# Altium schematic sheet Toberemoved_Principal.SchDoc
size A4; SheetNumber: 2; SheetTotal: 6
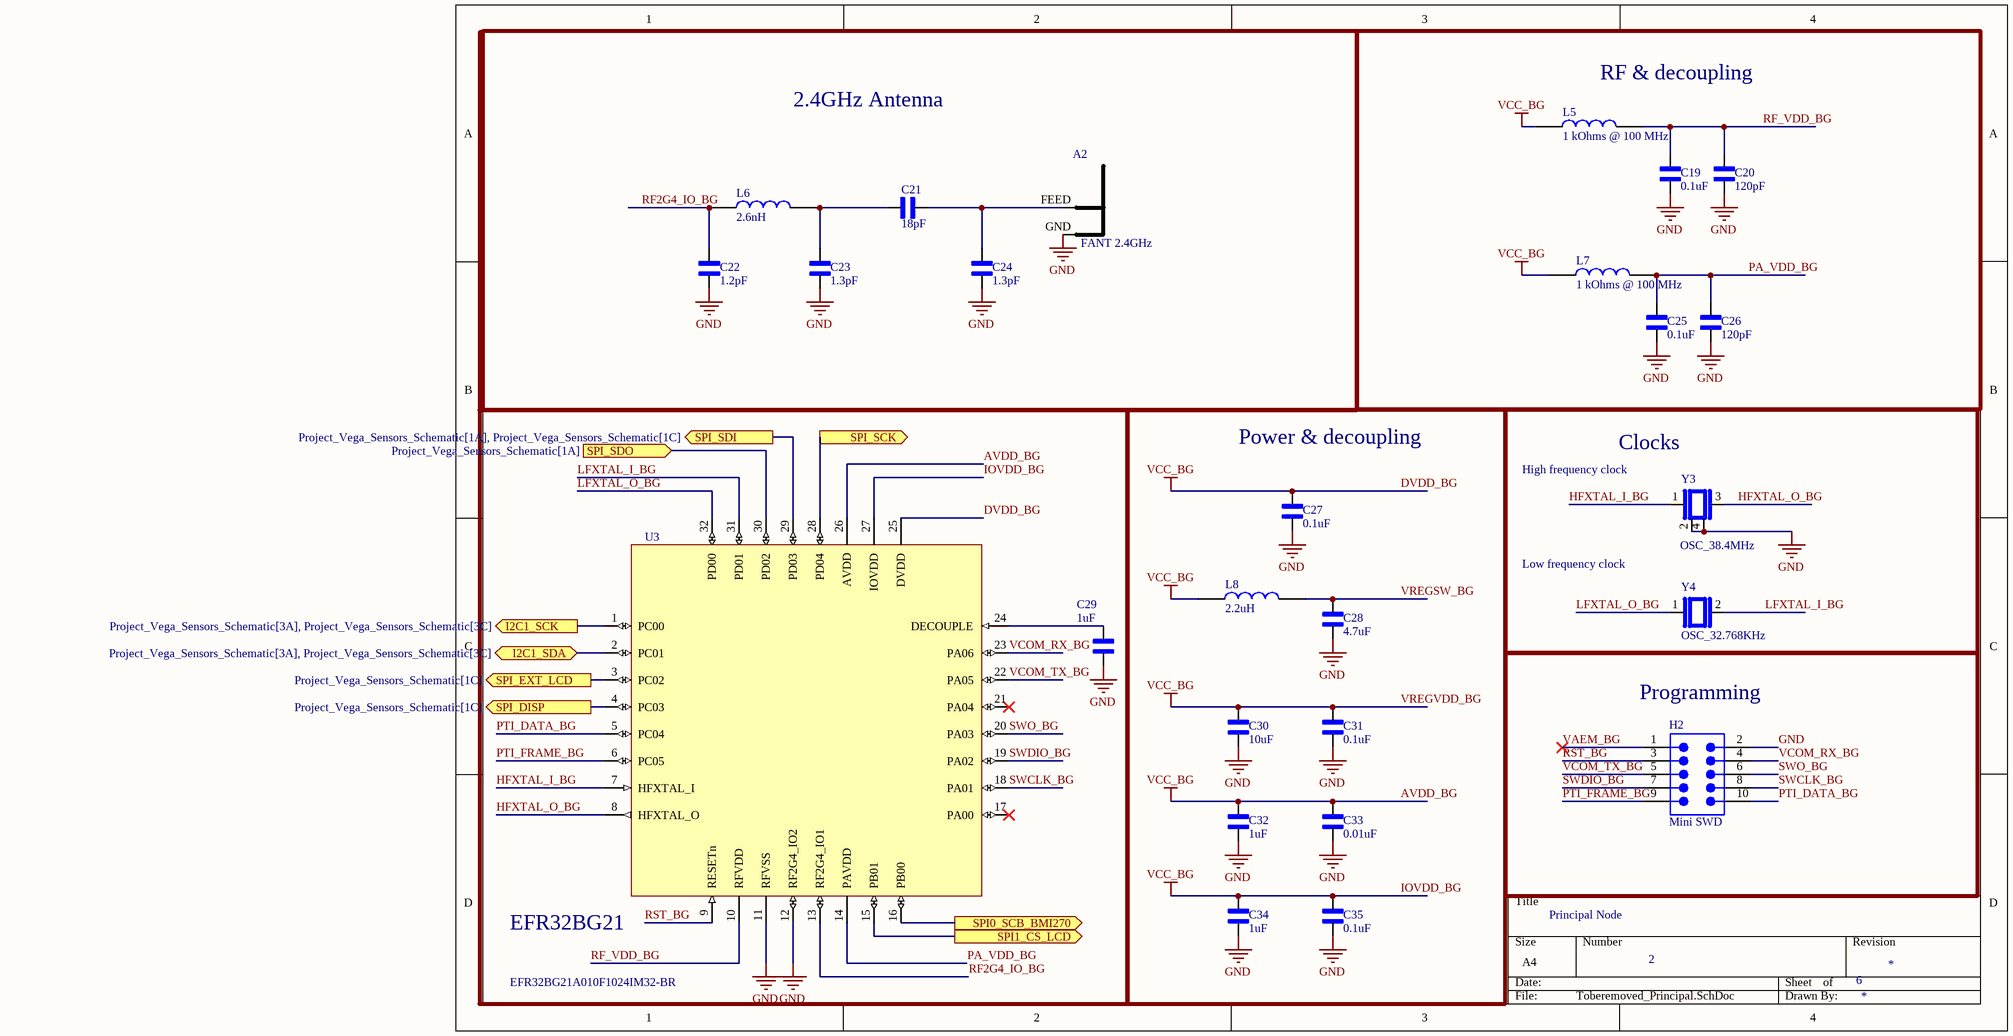
[diagram p0: Toberemoved_Principal.SchDoc]

## Parts
A2  FANT 2.4GHz  [FANT_2P4]
C19  0.1uF  [CAPC1608X90]
C20  120pF  [CAPC1608X90]
C21  18pF  [CAPC1608X90]
C22  1.2pF  [CAPC1608X90]
C23  1.3pF  [CAPC1608X90]
C24  1.3pF  [CAPC1608X90]
C25  0.1uF  [CAPC1608X90]
C26  120pF  [CAPC1608X90]
C27  0.1uF  [CAPC1608X90]
C28  4.7uF  [CAPC1608X90]
C29  1uF  [CAPC1608X90]
C30  10uF  [CAPC1608X90]
C31  0.1uF  [CAPC1608X90]
C32  1uF  [CAPC1608X90]
C33  0.01uF  [CAPC1608X90]
C34  1uF  [CAPC1608X90]
C35  0.1uF  [CAPC1608X90]
H2  Mini SWD  [FTSH-105-01-XXX-DV-K]
L5  1 kOhms @ 100 MHz  [INDC1608X95N]
L6  2.6nH  [INDC1608X95N]
L7  1 kOhms @ 100 MHz  [INDC1608X95N]
L8  2.2uH  [INDC1608X95N]
U3  EFR32BG21A010F1024IM32-BR  [QFN32-EFR32xG2xIM32-BR]
Y3  OSC_38.4MHz  [OSC_38.4MHz]
Y4  OSC_32.768KHz  [OSC_32.768KHz]

## Blocks framed on the sheet
2.4GHz Antenna: A2 C21-C24 L6
RF & decoupling: C19 C20 C25 C26 L5 L7
EFR32BG21: C29 U3
Power & decoupling: C27 C28 C30-C35 L8
Clocks: Y3 Y4
Programming: H2

## Ports
I2C1_SCK (out, see Project_Vega_Sensors_Schematic[3A], Project_Vega_Sensors_Schematic[3C]), I2C1_SDA (bidir, see Project_Vega_Sensors_Schematic[3A], Project_Vega_Sensors_Schematic[3C]), SPI0_SCB_BMI270 (out, see Project_Vega_Sensors_Schematic[1A]), SPI1_CS_LCD (out, see Project_Vega_Sensors_Schematic[1C]), SPI_DISP (out, see Project_Vega_Sensors_Schematic[1C]), SPI_EXT_LCD (out, see Project_Vega_Sensors_Schematic[1C]), SPI_SCK (out, see Project_Vega_Sensors_Schematic[1A], Project_Vega_Sensors_Schematic[1C]), SPI_SDI (out, see Project_Vega_Sensors_Schematic[1A], Project_Vega_Sensors_Schematic[1C]), SPI_SDO (in, see Project_Vega_Sensors_Schematic[1A])

## Nets
AVDD_BG: C27.1 C30.1 C31.1 C32.1 C33.1 C34.1 C35.1 L5.1 L7.1 L8.1 U3.25(DVDD) U3.26(AVDD) U3.27(IOVDD)  [also labelled DVDD_BG, IOVDD_BG, VCC_BG, VREGVDD_BG]
GND: A2.GND C19.2 C20.2 C22.2 C23.2 C24.2 C25.2 C26.2 C27.2 C28.2 C29.2 C30.2 C31.2 C32.2 C33.2 C34.2 C35.2 H2.2 U3.11(RFVSS) U3.12(RF2G4_IO2) Y3.2 Y3.4
HFXTAL_I_BG: U3.7(HFXTAL_I) Y3.1
HFXTAL_O_BG: U3.8(HFXTAL_O) Y3.3
I2C1_SCK: U3.1(PC00) ; port I2C1_SCK
I2C1_SDA: U3.2(PC01) ; port I2C1_SDA
LFXTAL_I_BG: U3.31(PD01) Y4.2
LFXTAL_O_BG: U3.32(PD00) Y4.1
PA_VDD_BG: C25.1 C26.1 L7.2 U3.14(PAVDD)
PTI_DATA_BG: H2.10 U3.5(PC04)
PTI_FRAME_BG: H2.9 U3.6(PC05)
RF2G4_IO_BG: C22.1 L6.1 U3.13(RF2G4_IO1)
RF_VDD_BG: C19.1 C20.1 L5.2 U3.10(RFVDD)
RST_BG: H2.3 U3.9(RESETn)
SPI0_SCB_BMI270: U3.16(PB00) ; port SPI0_SCB_BMI270
SPI1_CS_LCD: U3.15(PB01) ; port SPI1_CS_LCD
SPI_DISP: U3.4(PC03) ; port SPI_DISP
SPI_EXT_LCD: U3.3(PC02) ; port SPI_EXT_LCD
SPI_SCK: U3.28(PD04) ; port SPI_SCK
SPI_SDI: U3.29(PD03) ; port SPI_SDI
SPI_SDO: U3.30(PD02) ; port SPI_SDO
SWCLK_BG: H2.8 U3.18(PA01)
SWDIO_BG: H2.7 U3.19(PA02)
SWO_BG: H2.6 U3.20(PA03)
VAEM_BG: H2.1
VCOM_RX_BG: H2.4 U3.23(PA06)
VCOM_TX_BG: H2.5 U3.22(PA05)
VREGSW_BG: C28.1 L8.2
NetA2_FEED: A2.FEED C21.2 C24.1
NetC21_1: C21.1 C23.1 L6.2
NetC29_1: C29.1 U3.24(DECOUPLE)

Not connected (* = marked no-connect by the designer): U3 17(PA00)* 21(PA04)*

## Notes on the sheet
- (near Y3) High frequency clock
- Low frequency clock
- Principal Node

## Library data of the parts
A2 = FANT_2P4: Inverted F antenna
C19-C35 = CC0603KRX7R9BB104: 0.1 ÂµF Â±10% 50V Ceramic Capacitor X7R 0603 (1608 Metric); MF: Yageo; SnapEDA_Link: https://www.snapeda.com/parts/CC0603KRX7R9BB104/Yageo/view-part/?ref=snap; Package: 0603 Yageo; Value: *; MP: CC0603KRX7R9BB104; Check_prices: https://www.snapeda.com/parts/CC0603KRX7R9BB104/Yageo/view-part/?ref=eda
H2 = Debug Connector Mini SWD - 0.05": Mini SWD 0.05" Pitch Connector - 10 Pin SMT Box Header; Manufacturer: Adafruit Industries; Manufacturer Part Number: 4048; Supplier 1: Digi-Key; RoHS: No; Category: Connectors; Stock 1: 201; Pricing 1: 1=1.95000 (USD); ComponentLink1URL: https://media.digikey.com/pdf/Data%20Sheets/Adafruit%20PDFs/4048_Web.pdf?src-supplier=Digi-Key; ComponentLink1Description: https://media.digikey.com/pdf/Data%20Sheets/Adafruit%20PDFs/4048_Web.pdf?src-supplier=Digi-Key
L5-L8 = LQM18DN100M70L: Inductor with Inductance 10uH Tol.+/-20% Package 0603 (1608); MF: Murata Electronics; MP: LQM18DN100M70L; Price: None; SnapEDA_Link: https://www.snapeda.com/parts/LQM18DN100M70L/Murata/view-part/4834755/?ref=snap; Package: 0603 Murata; Availability: Unavailable; Value: *
U3 = EFR32BG21A010F1024IM32-BR: Blue Gecko, QFN32, 2.4G, 10dB, Bluetooth 5.1, 1024kB, 96kB(RAM), 20 GPIO; Manufacturer: Silicon Labs; Supplier: Digikey; Supplier Part Number: 336-5869-1-ND; Manufacturer Part Number: EFR32BG21A010F1024IM32-BR; RoHS: No; Category: RF Receivers, Transceivers; Stock: 38892; Pricing: 1=4.27, 10=3.816, 25=3.4348, 100=3.1293, 250=2.82404, 500=2.6875 (USD); ComponentLink1URL: https://www.silabs.com/documents/login/data-sheets/efr32bg21-datasheet.pdf?src-supplier=Digikey; ComponentLink1Description: https://www.silabs.com/documents/login/data-sheets/efr32bg21-datasheet.pdf?src-supplier=Digikey; ComponentLink2URL: https://datasheet.octopart.com/EFR32BG21A010F1024IM32-BR-Silicon-Labs-datasheet-142046433.pdf?src-supplier=Arrow.cn; ComponentLink2Description: https://datasheet.octopart.com/EFR32BG21A010F1024IM32-BR-Silicon-Labs-datasheet-142046433.pdf?src-supplier=Arrow.cn
Y3 = OSC_38.4MHz: 38.4 MHz ±10ppm Crystal 10pF 40 Ohms 4-SMD, No Lead; MF: {'manufacturer': u'Murata Electronics'}; MP: XRCGB38M400F2P00R0; Package: None; Price: None; Value: *; Availability: Unavailable; Supplier 1: Digikey; Supplier Part Number 1: 4606-TZ3398BCT-ND
Y4 = OSC_32.768KHz: Tuning Fork Crystal 32.768kHz in 1.2 x 2.0mm package; MF: Micro Crystal; MP: CM8V-T1A-32.768KHZ-7PF-20PPM-TA-QC; Package: SMD-2 Micro Crystal; Price: None; Value: *; SnapEDA_Link: https://www.snapeda.com/parts/CM8V-T1A-32.768KHZ-7PF-20PPM-TA-QC/Micro+Crystal/view-part/?ref=snap; Availability: Not in stock; Check_prices: https://www.snapeda.com/parts/CM8V-T1A-32.768KHZ-7PF-20PPM-TA-QC/Micro+Crystal/view-part/?ref=eda; Supplier 1: Digikey; Supplier Part Number 1: 2195-CM8V-T1A-32.768KHZ-7PF-20PPM-TA-QCCT-ND